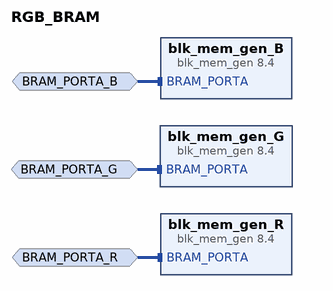
[diagram p0: block diagram of the top level]
# Vivado block design RGB_BRAM, xc7z020clg400-1, Vivado 2018.3
create_bd_design RGB_BRAM

create_bd_intf_port -mode Slave -vlnv xilinx.com:interface:bram_rtl:1.0 BRAM_PORTA_R
create_bd_intf_port -mode Slave -vlnv xilinx.com:interface:bram_rtl:1.0 BRAM_PORTA_G
create_bd_intf_port -mode Slave -vlnv xilinx.com:interface:bram_rtl:1.0 BRAM_PORTA_B

create_bd_cell -type ip -vlnv xilinx.com:ip:blk_mem_gen:8.4 blk_mem_gen_R
set_property -dict [list \
  CONFIG.Coe_File ../../../../new/BRAM_R_Init.coe \
  CONFIG.Enable_32bit_Address false \
  CONFIG.Enable_A Always_Enabled \
  CONFIG.Load_Init_File true \
  CONFIG.Read_Width_A 8 \
  CONFIG.Register_PortA_Output_of_Memory_Primitives true \
  CONFIG.Use_Byte_Write_Enable false \
  CONFIG.Use_RSTA_Pin false \
  CONFIG.Write_Depth_A 130560 \
  CONFIG.Write_Width_A 8 \
  CONFIG.use_bram_block Stand_Alone \
] [get_bd_cells blk_mem_gen_R]
create_bd_cell -type ip -vlnv xilinx.com:ip:blk_mem_gen:8.4 blk_mem_gen_B
set_property -dict [list \
  CONFIG.Coe_File ../../../../new/BRAM_B_Init.coe \
  CONFIG.Enable_32bit_Address false \
  CONFIG.Enable_A Always_Enabled \
  CONFIG.Load_Init_File true \
  CONFIG.Read_Width_A 8 \
  CONFIG.Register_PortA_Output_of_Memory_Primitives true \
  CONFIG.Use_Byte_Write_Enable false \
  CONFIG.Use_RSTA_Pin false \
  CONFIG.Write_Depth_A 130560 \
  CONFIG.Write_Width_A 8 \
  CONFIG.use_bram_block Stand_Alone \
] [get_bd_cells blk_mem_gen_B]
create_bd_cell -type ip -vlnv xilinx.com:ip:blk_mem_gen:8.4 blk_mem_gen_G
set_property -dict [list \
  CONFIG.Coe_File ../../../../new/BRAM_G_Init.coe \
  CONFIG.Enable_32bit_Address false \
  CONFIG.Enable_A Always_Enabled \
  CONFIG.Load_Init_File true \
  CONFIG.Read_Width_A 8 \
  CONFIG.Register_PortA_Output_of_Memory_Primitives true \
  CONFIG.Use_Byte_Write_Enable false \
  CONFIG.Use_RSTA_Pin false \
  CONFIG.Write_Depth_A 130560 \
  CONFIG.Write_Width_A 8 \
  CONFIG.use_bram_block Stand_Alone \
] [get_bd_cells blk_mem_gen_G]

# ---- connections ----

connect_bd_intf_net -intf_net BRAM_PORTA_1_1 [get_bd_intf_ports BRAM_PORTA_G] [get_bd_intf_pins blk_mem_gen_G/BRAM_PORTA]
connect_bd_intf_net -intf_net BRAM_PORTA_0_1 [get_bd_intf_ports BRAM_PORTA_R] [get_bd_intf_pins blk_mem_gen_R/BRAM_PORTA]
connect_bd_intf_net -intf_net BRAM_PORTA_2_1 [get_bd_intf_ports BRAM_PORTA_B] [get_bd_intf_pins blk_mem_gen_B/BRAM_PORTA]

validate_bd_design
save_bd_design
